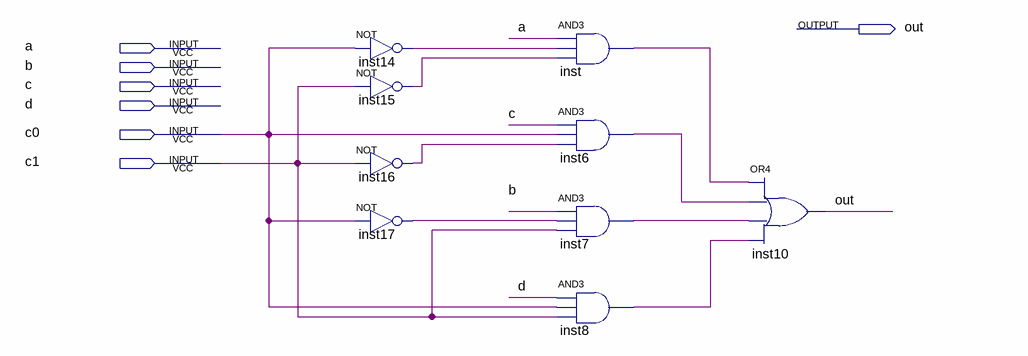
[diagram p0: schematic sheet]
// Quartus schematic MUX4x1_1.bdf as structural Verilog: 9 symbols, 7 pins
module MUX4x1_1 (
  input  a,
  input  b,
  input  c,
  input  d,
  input  c0,
  input  c1,
  output out
);

  wire inst6_out, inst7_out, inst8_out, inst14_out, inst15_out, inst16_out, inst17_out, inst_out;

  not inst14 (inst14_out, c0);
  not inst15 (inst15_out, c1);
  not inst16 (inst16_out, c1);
  not inst17 (inst17_out, c0);
  and inst (inst_out, a, inst14_out, inst15_out);
  and inst6 (inst6_out, c, c0, inst16_out);
  and inst7 (inst7_out, b, inst17_out, c1);
  and inst8 (inst8_out, d, c0, c1);
  or inst10 (out, inst_out, inst6_out, inst7_out, inst8_out);
endmodule
